# EasyEDA Pro project alarm.eprj

# Schematic 简易闹钟
Board Name: Board1; Create Date: 2024-09-03; Drawed: 陈家耀; Page Size: A3
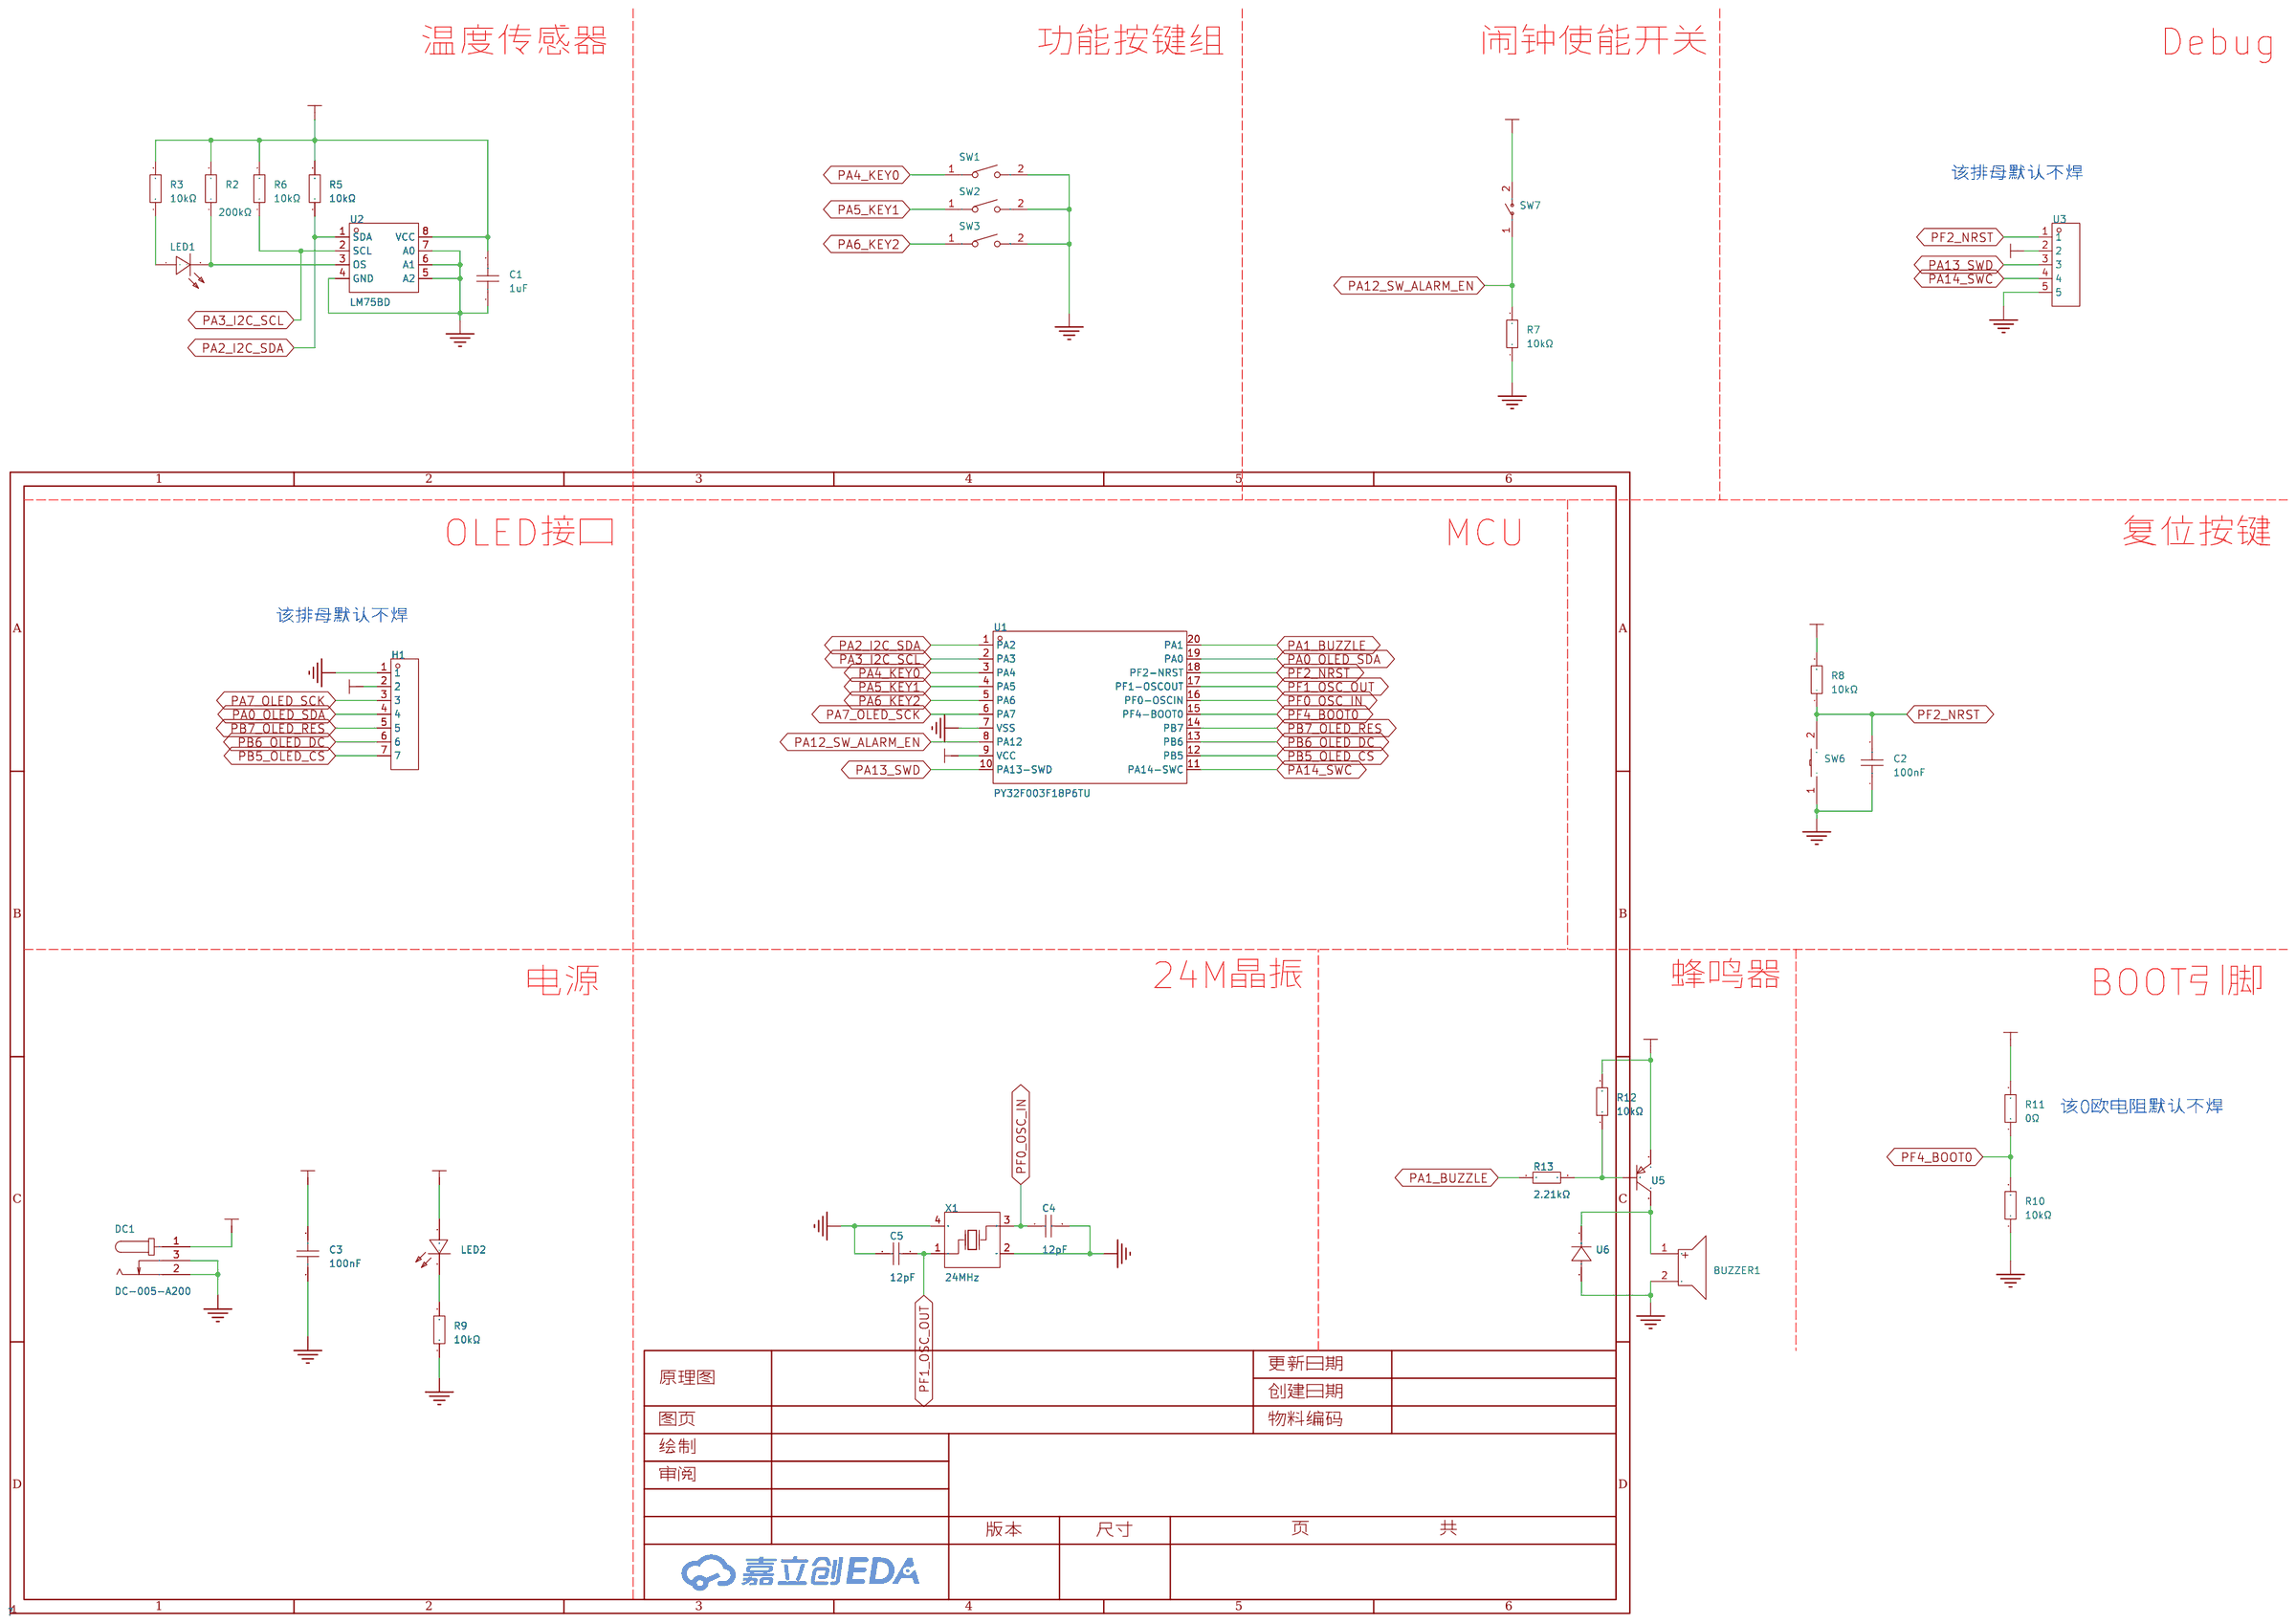
[diagram p0: schematic sheet]

## Parts
BUZZER1  2.7kHz  [BUZ-TH_BD9.0-P4.00-D0.6-FD]
C1  1uF  [C0603]
C2  100nF  [C0603]
C3  100nF  [C0603]
C4  12pF  [C0603]
C5  12pF  [C0603]
DC1  DC-005-A200  [DC-IN-TH_DC-005-A200]
H1  BX-PM2.54-1-7PY  [HDR-TH_7P-P2.54-V-F]
LED1  NCD0805R1  [LED0805-R-RD]
LED2  NCD0805R1  [LED0805-R-RD]
R2  200kΩ  [R0603]
R3  10kΩ  [R0603]
R5  10kΩ  [R0603]
R6  10kΩ  [R0603]
R7  10kΩ  [R0603]
R8  10kΩ  [R0603]
R9  10kΩ  [R0603]
R10  10kΩ  [R0603]
R11  0Ω  [R0805]
R12  10kΩ  [R0603]
R13  2.21kΩ  [R0603]
SW1  TS-1088-AR02016  [SW-SMD_L3.9-W3.0-P4.45]
SW2  TS-1088-AR02016  [SW-SMD_L3.9-W3.0-P4.45]
SW3  TS-1088-AR02016  [SW-SMD_L3.9-W3.0-P4.45]
SW6  TS-1101-C-W  [SW-SMD_L6.0-W3.3-LS8.0]
SW7  KCD11-2P-R  [SW-TH_2P-L15.0-W10.5-P5.00_KCD11-2P-R]
U1  PY32F003F18P6TU  [TSSOP-20_L6.5-W4.4-P0.65-LS6.4-BL]
U2  LM75BD  [SOIC-8_L4.9-W3.9-P1.27-LS6.0-BL]
U3  BX-PM2.54-1-5PY  [HDR-TH_5P-P2.54-V-F-B]
U5  MMBT3906  [SOT-23-3_L2.9-W1.3-P1.90-LS2.4-BR]
U6  1N4007W  [SOD-123FL_L2.7-W1.8-LS3.7-RD]
X1  24MHz  [CRYSTAL-SMD_4P-L3.2-W2.5-BL]

## Library data of the parts
BUZZER1 = QMB-09B-03: LCSC Part Name: 无源蜂鸣器QMB-09B-03; Supplier Part: C96256; Manufacturer: 华能; Supplier Footprint: 插件,D=9mm; Datasheet: https://atta.szlcsc.com/upload/public/pdf/source/20210401/C96256_958B17753B5AD7CBFBCFFC7C095B4484.pdf; Supplier: LCSC; Oscillator Circuit: 无源(外部驱动); Technology Type: 电磁式; Operating Voltage: 2V~5V; Sound Pressure Level (SPL): 85dB@3V,10cm; Diameter (φD): 9mm; Height: 5.7mm
C1 = CL10A105KB8NNNC: LCSC Part Name: 1uF ±10% 50V; Supplier Part: C15849; Manufacturer: SAMSUNG(三星); Supplier Footprint: 0603; Datasheet: https://atta.szlcsc.com/upload/public/pdf/source/20160218/1457707763339.pdf; Supplier: LCSC; Tolerance: ±10%; Voltage Rated: 50V; Temperature Coefficient: X5R
C2 C3 = CL10B104KB8NNNC: LCSC Part Name: 100nF ±10% 50V; Supplier Part: C1591; Manufacturer: SAMSUNG(三星); Supplier Footprint: 0603; Datasheet: https://atta.szlcsc.com/upload/public/pdf/source/20160218/1457707763339.pdf; Supplier: LCSC; Tolerance: ±10%; Voltage Rated: 50V; Temperature Coefficient: X7R
C4 C5 = CL10C120JB8NNNC: LCSC Part Name: 12pF ±5% 50V; Supplier Part: C38523; Manufacturer: SAMSUNG(三星); Supplier Footprint: 0603; Datasheet: https://atta.szlcsc.com/upload/public/pdf/source/20160218/1457707763339.pdf; Supplier: LCSC; Tolerance: ±5%; Voltage Rated: 50V; Temperature Coefficient: C0G
DC1 = DC-005-A200: LCSC Part Name: DC电源插座 内径:2mm 外径:6.4mm; Supplier Part: C720557; Manufacturer: XUNPU(讯普); Supplier Footprint: 插件; Datasheet: https://atta.szlcsc.com/upload/public/pdf/source/20200812/C720557_2286DFCD6C75B71AF905731F627ABF3A.pdf; Supplier: LCSC; Connector Type: DC电源插座; Mounting Style: 弯插; Inside Contact Diameter: 2mm; Outside Contact Diameter: 6.4mm; Current Rating (Max): 3A; Voltage Rating (Max): 30V; Operating Temperature Range: -20℃~+70℃
H1 = BX-PM2.54-1-7PY: LCSC Part Name: 1x7P 间距:2.54mm 直插; Supplier Part: C18078130; Manufacturer: Bossie(博锡); Supplier Footprint: 插件,P=2.54mm; Datasheet: https://atta.szlcsc.com/upload/public/pdf/source/20231017/5D8BA458A6A85FFD30CE44A2A3748583.pdf; Supplier: LCSC; Holes Structure: 1x7P; Pitch: 2.54mm; Circular Hole / Square Hole: 方孔; Mounting Type: 直插; Number of Rows: 单排; Number of Holes: 7P; Voltage Rating (Max): 1kV; Holes Direction: 顶部; Insulation Height: 8.5mm; Contact Plating: 金; Operating Temperature Range: -40℃~+105℃; Soldering Temperature(Max): 260℃@5S
LED1 LED2 = NCD0805R1: Supplier Part: C84256; Manufacturer: 国星光电; Supplier Footprint: 0805; Datasheet: https://atta.szlcsc.com/upload/public/pdf/source/20200820/C84256_F0A75A43B3EAD75808600A0514C76B99.pdf; Supplier: LCSC; Emitted Color: 红色; Forward Voltage (VF): 1.6V~2.6V; Power Dissipation: 65mW; Forward Current: 20mA; Dominant Wavelength: 615nm~630nm; Diode Configuration: 独立二极管; Lens Color: 无色透明透镜; Luminous Intensity: 67mcd~195mcd; Viewing Angle: 130°; Operating Temperature: -30℃~+85℃
R2 = 0603WAF2003T5E: LCSC Part Name: 200kΩ ±1% 100mW 厚膜电阻; Supplier Part: C25811; Manufacturer: UNI-ROYAL(厚声); Supplier Footprint: 0603; Datasheet: https://atta.szlcsc.com/upload/public/pdf/source/20200306/C422600_1E6D84923E4A46A82E41ADD87F860B5C.pdf; Supplier: LCSC; Type: 厚膜电阻; Tolerance: ±1%; Power(Watts): 100mW; Overload Voltage (Max): 75V; Temperature Coefficient: ±100ppm/℃; Operating Temperature Range: -55℃~+155℃
R3 R5-R10 R12 = 0603WAF1002T5E: LCSC Part Name: 厚膜电阻 10kΩ ±1% 100mW; Supplier Part: C25804; Manufacturer: UNI-ROYAL(厚声); Supplier Footprint: 0603; Datasheet: https://atta.szlcsc.com/upload/public/pdf/source/20200306/C422600_1E6D84923E4A46A82E41ADD87F860B5C.pdf; Supplier: LCSC; Type: 厚膜电阻; Tolerance: ±1%; Power(Watts): 100mW; Overload Voltage (Max): 75V; Temperature Coefficient: ±100ppm/℃; Operating Temperature Range: -55℃~+155℃
R11 = 0805W8F0000T5E: LCSC Part Name: 0Ω ±1% 125mW 厚膜电阻; Supplier Part: C17477; Manufacturer: UNI-ROYAL(厚声); Supplier Footprint: 0805; Datasheet: https://atta.szlcsc.com/upload/public/pdf/source/20200306/C422600_1E6D84923E4A46A82E41ADD87F860B5C.pdf; Supplier: LCSC; Type: 厚膜电阻; Tolerance: ±1%; Power(Watts): 125mW; Overload Voltage (Max): 150V; Temperature Coefficient: ±800ppm/℃; Operating Temperature Range: -55℃~+155℃
R13 = 0603WAF2211T5E: LCSC Part Name: 2.21kΩ ±1% 100mW 厚膜电阻; Supplier Part: C22903; Manufacturer: UNI-ROYAL(厚声); Supplier Footprint: 0603; Datasheet: https://atta.szlcsc.com/upload/public/pdf/source/20200306/C422600_1E6D84923E4A46A82E41ADD87F860B5C.pdf; Supplier: LCSC; Type: 厚膜电阻; Tolerance: ±1%; Power(Watts): 100mW; Overload Voltage (Max): 75V; Temperature Coefficient: ±100ppm/℃; Operating Temperature Range: -55℃~+155℃
SW1-SW3 = TS-1088-AR02016: LCSC Part Name: 4*3*2mm 立贴 轻触开关; Supplier Part: C720477; Manufacturer: XUNPU(讯普); Supplier Footprint: SMD; Datasheet: https://atta.szlcsc.com/upload/public/pdf/source/20200810/C720475_60D09DD6C54279ADDB2DC25100F1CC11.pdf; Supplier: LCSC; Circuit: 单刀单掷; Actuator Style: 圆形按钮; Operating Force: 160gf; Mounting Style: 立贴; Switch Length: 4mm; Switch Width: 3mm; Switch Height: 2mm; Strike Gundam: 不带; Contact Current: 50mA; Voltage Rating (DC): 12V; Insulation Resistance: 100MΩ; Actuator/Cap Color: 黑色; Pin Style: SMD接片; Mechanical Life: 10万次; Operating Temperature: -30℃~+80℃
SW6 = TS-1101-C-W: LCSC Part Name: 6*3.6*2.5mm 立贴 轻触开关; Supplier Part: C318938; Manufacturer: XKB Connectivity(中国星坤); Supplier Footprint: SMD; Datasheet: https://atta.szlcsc.com/upload/public/pdf/source/20200227/C318938_C2E53B1EEDE37D980A33616AC086DE53.pdf; Supplier: LCSC; Circuit: 单刀单掷; Actuator Style: 矩形按钮; Operating Force: 260gf; Mounting Style: 立贴; Switch Length: 6mm; Switch Width: 3.6mm; Switch Height: 2.5mm; Strike Gundam: 不带; Contact Current: 50mA; Voltage Rating (DC): 12V; Actuator/Cap Color: 白色带淡绿; With Lamp: 无; Mechanical Life: 5万次; Operating Temperature: -30℃~+85℃
SW7 = KCD11-2P-R: LCSC Part Name: 10.5*15mm 两脚两档跷板开关 红钮; Supplier Part: C5884414; Manufacturer: SHOU HAN(首韩); Supplier Footprint: 插件; Datasheet: https://atta.szlcsc.com/upload/public/pdf/source/20230506/CD06DFDE35C8048D34175BFF4AF6A2C2.pdf; Supplier: LCSC; Switch Length: 15mm; Switch Width: 10.5mm; Switch Height: 17.2mm; Actuator Type: 凹面弯曲; With Lamp: 无; Pin Style: 焊片; Actuator Color: 红色; Contact Current: 3A; Voltage Rating (AC): 250V; Circuit: 单刀单掷; Mechanical Life: 1万次; Operating Temperature: 0℃~+125℃; Actuator Identifier: - O
U1 = PY32F003F18P6TU: Supplier Part: C5379864; Manufacturer: PUYA(普冉); Supplier Footprint: TSSOP-20; Datasheet: https://atta.szlcsc.com/upload/public/pdf/source/20230614/9147D3030DCA6028D4889DF7CC1D56F6.pdf; Supplier: LCSC
U2 = LM75BD: Supplier Part: C725792; Manufacturer: UMW(友台半导体); Supplier Footprint: SOIC-8; Datasheet: https://atta.szlcsc.com/upload/public/pdf/source/20231109/1C60228B21A525FC8BE076B0D6A6FC17.pdf; Supplier: LCSC; Temperature range: -55℃~+125℃; Resolution: ±3℃; Supply Voltage: 2.8V~5.5V; Interface Type: I2C
U3 = BX-PM2.54-1-5PY: LCSC Part Name: 1x5P 间距:2.54mm 直插; Supplier Part: C18078128; Manufacturer: Bossie(博锡); Supplier Footprint: 插件,P=2.54mm; Datasheet: https://atta.szlcsc.com/upload/public/pdf/source/20231017/37C8F5FAB43404E6812AB2AE4BBAB039.pdf; Supplier: LCSC; Holes Structure: 1x5P; Pitch: 2.54mm; Circular Hole / Square Hole: 方孔; Mounting Type: 直插; Number of Rows: 单排; Number of Holes: 5P; Voltage Rating (Max): 1kV; Holes Direction: 顶部; Insulation Height: 8.5mm; Contact Plating: 金; Operating Temperature Range: -40℃~+105℃; Soldering Temperature(Max): 260℃@5S
U5 = MMBT3906_C7420354: LCSC Part Name: 耐压:40V 电流:200mA PNP; Supplier Part: C7420354; Manufacturer: 宏迦橙; Supplier Footprint: SOT-23; Datasheet: https://atta.szlcsc.com/upload/public/pdf/source/20231222/C57AF7F09D8B4437DE7730975D81C46C.pdf; Supplier: LCSC; Transistor Type: PNP; Collector Current (Ic): 200mA; Collector-Emitter Breakdown Voltage (Vceo): 40V; Power Dissipation (Pd): 300mW; DC Current Gain (hFE@Ic,Vce): 100@10mA,1.0V; Transition Frequency (fT): 300MHz; Collector Cut-Off Current (Icbo): 100nA; Collector-Emitter Saturation Voltage (VCE(sat)@Ic,Ib): 300mV@50mA,5.0mA; Operating Temperature: -55℃~+150℃
U6 = 1N4007W_C7528871: LCSC Part Name: 电压:1kV 电流:1A; Supplier Part: C7528871; Manufacturer: MSKSEMI(美森科); Supplier Footprint: SOD-123FL; Datasheet: https://atta.szlcsc.com/upload/public/pdf/source/20230821/E9E7B8A13216AEAB33D679873610DFE6.pdf; Supplier: LCSC; Diode Configuration: 独立式; Forward Voltage (Vf@If): 1.1V@1A; Reverse Voltage (Vr): 1kV; Rectified Current: 1A
X1 = X322524MOB4SI: LCSC Part Name: 24MHz ±10ppm 12pF; Supplier Part: C70590; Manufacturer: YXC(扬兴晶振); Supplier Footprint: SMD3225-4P; Datasheet: https://atta.szlcsc.com/upload/public/pdf/source/20240329/19D5F850207469550BEB00D7DFEDBC7A.pdf; Supplier: LCSC; Crystal Type: 贴片晶振; Normal temperature Frequency Tolerance: ±10ppm; External load capacitor: 12pF; Frequency Stability(Full temperature range): ±20ppm; Operating Temperature: -40℃~+85℃

## Nets
3V3: C1.2 C3.2 DC1.1 H1.2 LED2.1(+) R2.2 R3.2 R5.2 R6.2 R8.2 R11.2 R12.2 SW7.2 U1.9(VCC) U2.8(VCC) U3.2 U5.2(E)
GND: BUZZER1.2 C1.1 C2.1 C3.1 C4.2 C5.1 DC1.2 DC1.3 H1.1 R7.1 R9.1 R10.1 SW1.2 SW2.2 SW3.2 SW6.1 U1.7(VSS) U2.4(GND) U2.5(A2) U2.6(A1) U2.7(A0) U3.5 U6.2(A) X1.2(GND) X1.4(GND)
PA0_OLED_SDA: H1.4 U1.19(PA0)
PA1_BUZZLE: R13.1 U1.20(PA1)
PA2_I2C_SDA: R5.1 U1.1(PA2) U2.1(SDA)
PA3_I2C_SCL: R6.1 U1.2(PA3) U2.2(SCL)
PA4_KEY0: SW1.1 U1.3(PA4)
PA5_KEY1: SW2.1 U1.4(PA5)
PA6_KEY2: SW3.1 U1.5(PA6)
PA7_OLED_SCK: H1.3 U1.6(PA7)
PA12_SW_ALARM_EN: R7.2 SW7.1 U1.8(PA12)
PA13_SWD: U1.10(PA13-SWD) U3.3
PA14_SWC: U1.11(PA14-SWC) U3.4
PB5_OLED_CS: H1.7 U1.12(PB5)
PB6_OLED_DC: H1.6 U1.13(PB6)
PB7_OLED_RES: H1.5 U1.14(PB7)
PF0_OSC_IN: C4.1 U1.16(PF0-OSCIN) X1.3(OSC2)
PF1_OSC_OUT: C5.2 U1.17(PF1-OSCOUT) X1.1(OSC1)
PF2_NRST: C2.2 R8.1 SW6.2 U1.18(PF2-NRST) U3.1
PF4_BOOT0: R10.2 R11.1 U1.15(PF4-BOOT0)
$1N1333: LED1.2(-) R2.1 U2.3(OS)
$1N1526: LED1.1(+) R3.1
$1N4383: LED2.2(-) R9.2
$1N7361: R12.1 R13.2 U5.1(B)
$1N7544: BUZZER1.1 U5.3(C) U6.1(K)

## Notes on the sheet
- 温度传感器
- 功能按键组
- 闹钟使能开关
- Debug
- 该排母默认不焊
- OLED接口
- MCU
- 复位按键
- 该排母默认不焊
- 24M晶振
- 蜂鸣器
- 电源
- BOOT引脚
- 该0欧电阻默认不焊

# Board PCB1
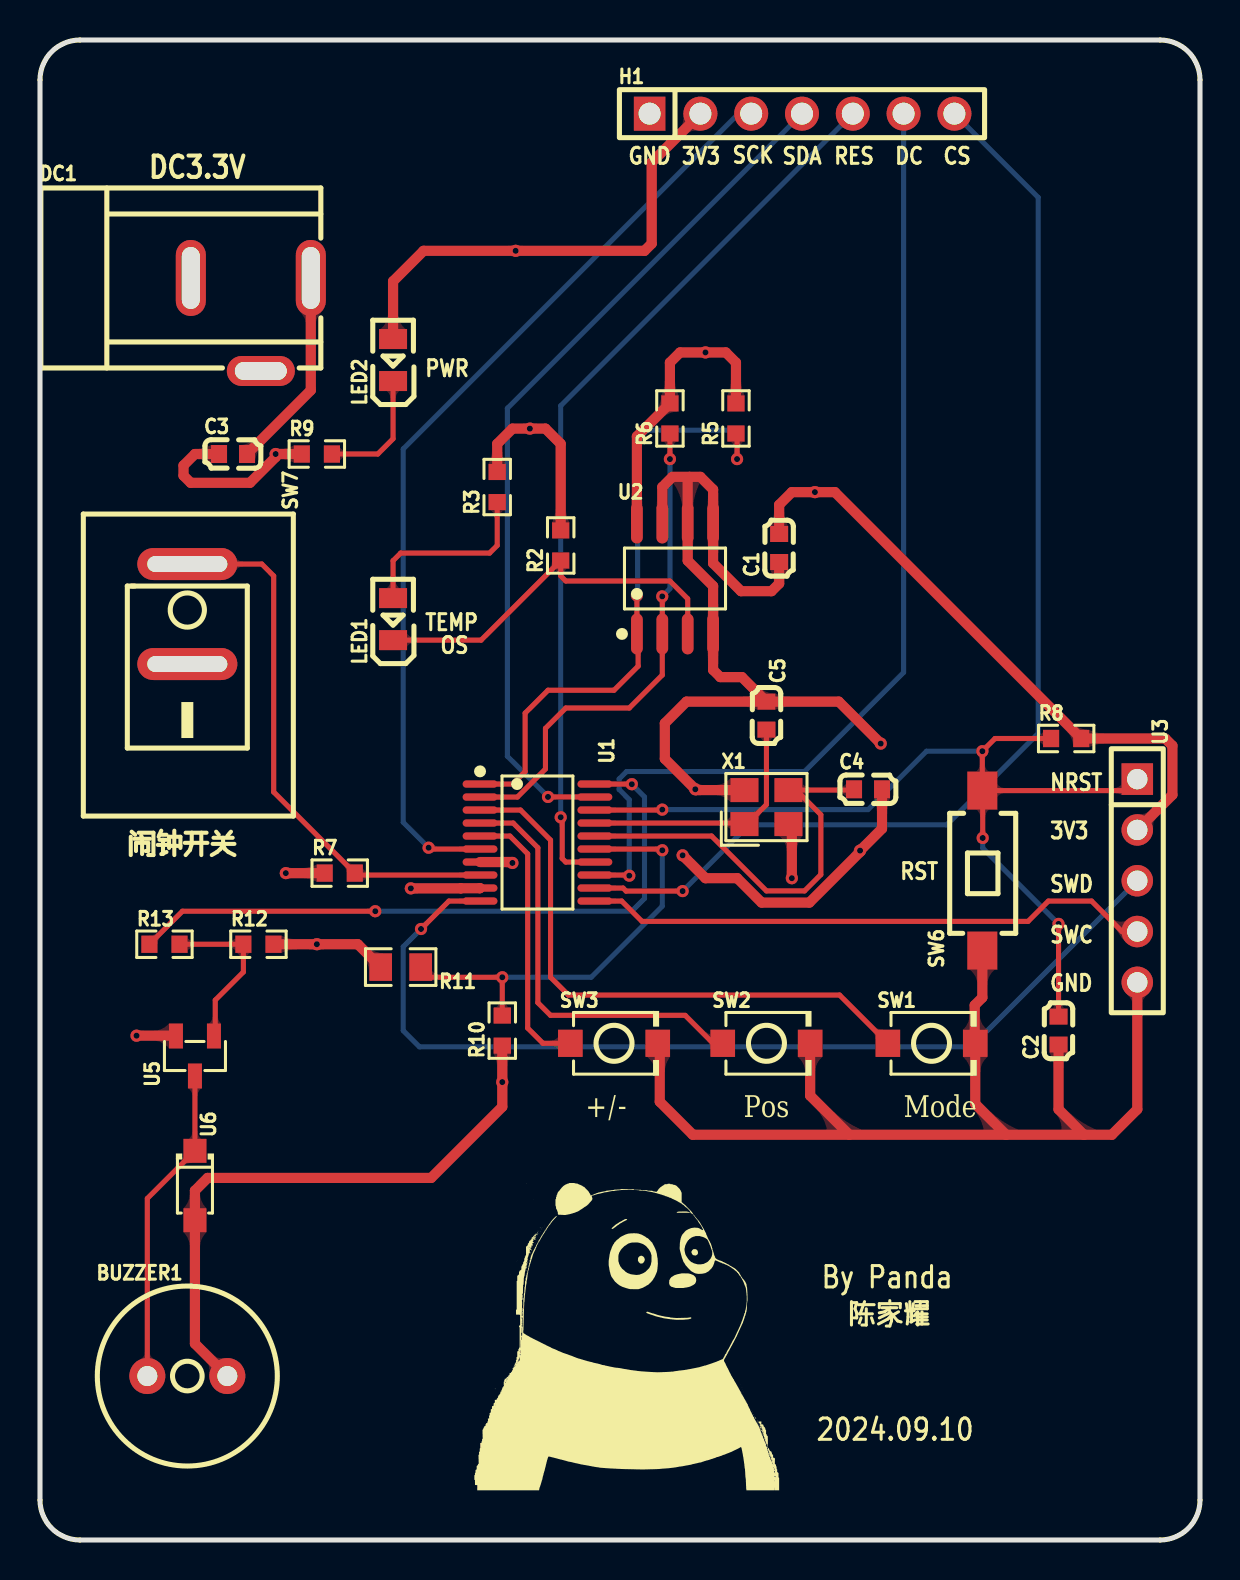
[diagram p1: board, top side]
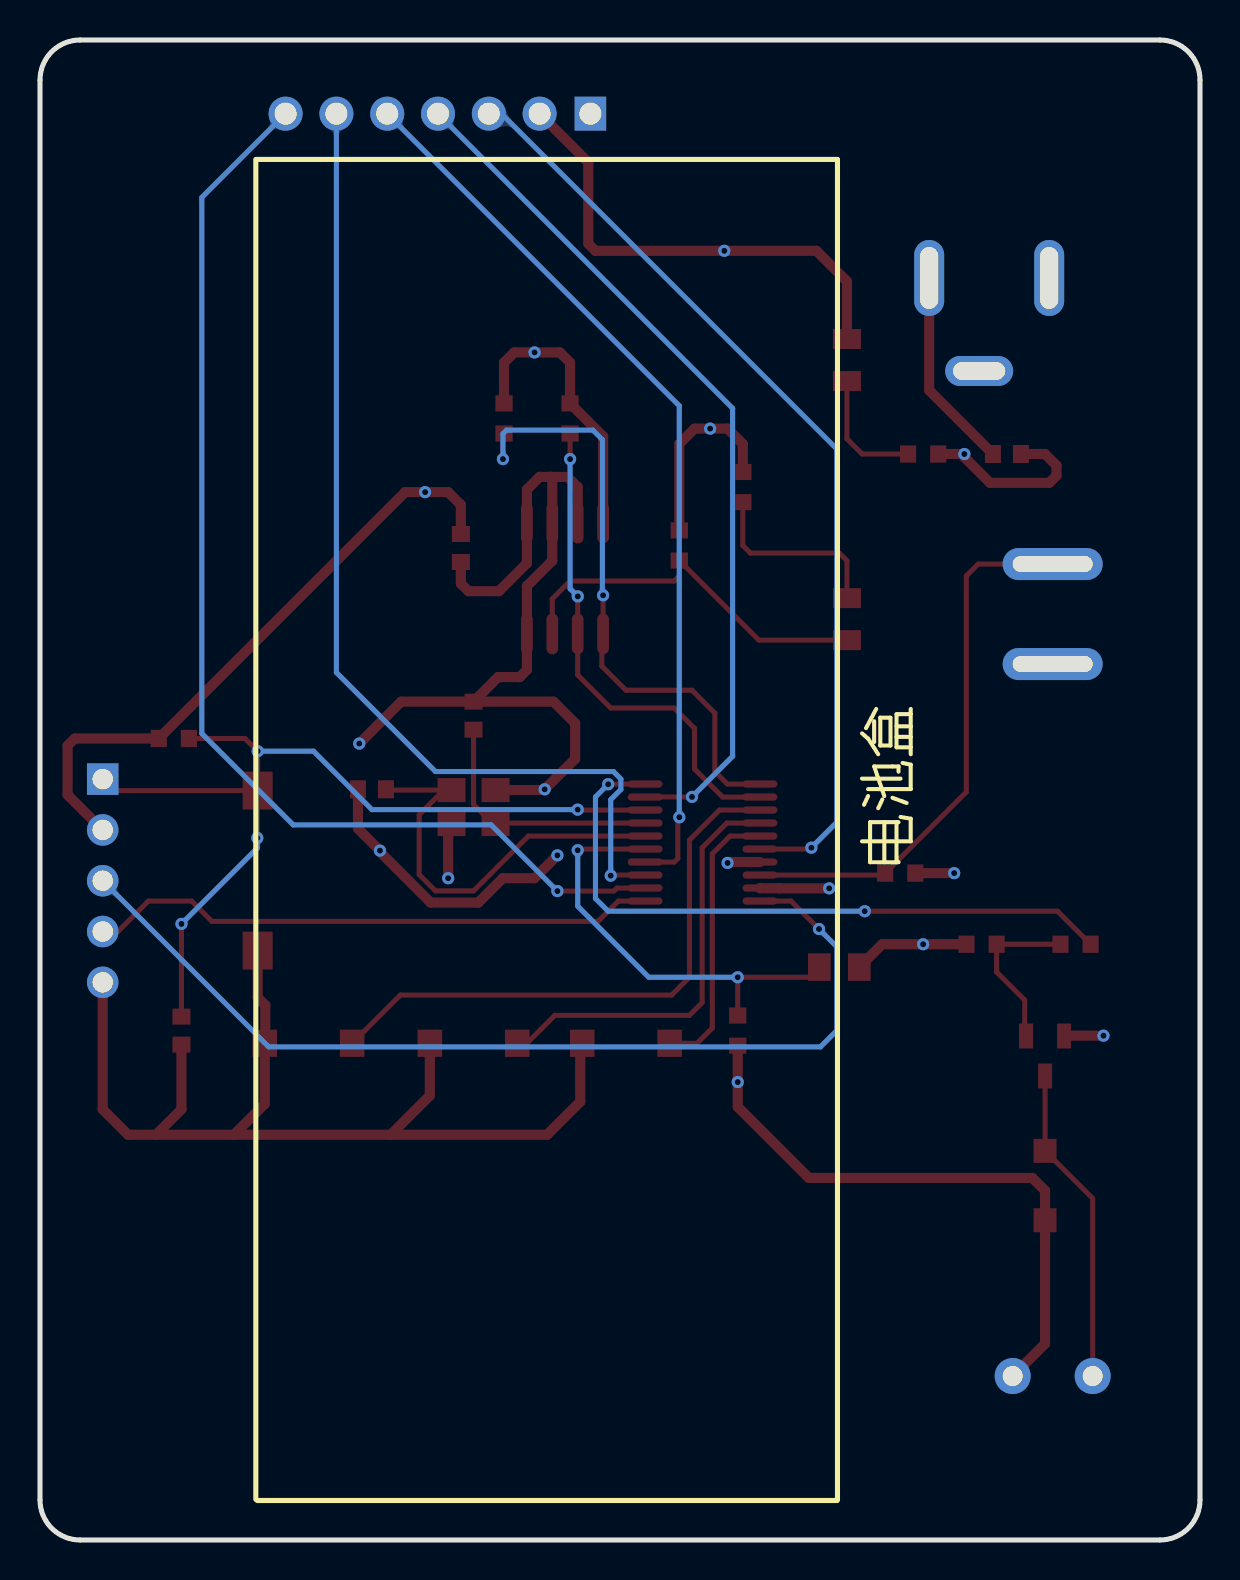
[diagram p2: board, bottom side, seen from below]

Outline 58 x 75 mm; copper layers: Top Layer, Inner1, Inner2, Bottom Layer. Coordinates in mm from the lower left corner of the outline.
Outline path: 0,73 0,2 arc(0.59,0.59) 2,0 56,0 arc(57.41,0.59) 58,2 58,73 arc(57.41,74.41) 56,75 2,75 arc(0.59,74.41) 0,73
Stack: Top Layer 0.035mm 外层铜厚1oz / Dielectric1 0.2104mm 7628 RC49% 8.6mil / Inner1 0.0152mm 内层铜厚 / Dielectric2 1.065mm 1.1mm H/HOZ Copper / Inner2 0.0152mm 内层铜厚 / Dielectric3 0.2104mm 7628 RC49% 8.6mil / Bottom Layer 0.035mm 外层铜厚1oz

## Design rules (mm)
net GND: pwr
net 3V3: pwr
template: 自定义配置
spacing copperThickness1oz (default): track to track 0.203, other pairs 0.203 to 0.203
spacing copperThickness2oz: track to track 0.203, other pairs 0.152 to 0.3
track width copperThickness1oz (default): min 0.152, default 0.254, max 2.54
track width copperThickness2oz: min 0.203, default 0.254, max 2.54
track width pwr: min 0.508, default 0.508, max 2.54
differential pair differentialPair (default): width min 0.152, default 0.254, max 2.54; gap min 0.152, default 0.152
via viaSize (default): diameter min 0.61, default 0.61, max 10; hole min 0.305, default 0.305, max 6.299
net class pwr uses pwr
net GND uses pwr
net 3V3 uses pwr

## Placement (name value [footprint] x y rotation side)
BUZZER1  2.7kHz  [BUZ-TH_BD9.0-P4.00-D0.6-FD]  7.37 8.2 0 top
C1  1uF  [C0603]  36.96 49.6 90 top
C2  100nF  [C0603]  50.93 25.47 90 top
C3  100nF  [C0603]  9.65 54.3 0 top
C4  12pF  [C0603]  41.4 37.53 0 top
C5  12pF  [C0603]  36.32 41.22 270 top
DC1  DC-005-A200  [DC-IN-TH_DC-005-A200]  10.54 60.78 0 top
H1  BX-PM2.54-1-7PY  [HDR-TH_7P-P2.54-V-F]  38.1 71.32 0 top
LED1  NCD0805R1  [LED0805-R-RD]  17.65 46.04 90 top
LED2  NCD0805R1  [LED0805-R-RD]  17.65 59 90 top
R2  200kΩ  [R0603]  26.03 49.73 90 top
R3  10kΩ  [R0603]  22.86 52.65 90 top
R5  10kΩ  [R0603]  34.8 56.08 90 top
R6  10kΩ  [R0603]  31.5 56.08 90 top
R7  10kΩ  [R0603]  14.99 33.34 0 top
R8  10kΩ  [R0603]  51.31 40.08 0 top
R9  10kΩ  [R0603]  13.84 54.3 0 top
R10  10kΩ  [R0603]  23.11 25.47 90 top
R11  0Ω  [R0805]  18.03 28.64 180 top
R12  10kΩ  [R0603]  10.92 29.79 0 top
R13  2.21kΩ  [R0603]  6.22 29.79 0 top
SW1  TS-1088-AR02016  [SW-SMD_L3.9-W3.0-P4.45]  44.58 24.83 0 top
SW2  TS-1088-AR02016  [SW-SMD_L3.9-W3.0-P4.45]  36.32 24.83 0 top
SW3  TS-1088-AR02016  [SW-SMD_L3.9-W3.0-P4.45]  28.7 24.83 0 top
SW6  TS-1101-C-W  [SW-SMD_L6.0-W3.3-LS8.0]  47.12 33.47 90 top
SW7  KCD11-2P-R  [SW-TH_2P-L15.0-W10.5-P5.00_KCD11-2P-R]  7.37 46.3 270 top
U1  PY32F003F18P6TU  [TSSOP-20_L6.5-W4.4-P0.65-LS6.4-BL]  24.87 34.87 270 top
U2  LM75BD  [SOIC-8_L4.9-W3.9-P1.27-LS6.0-BL]  31.75 48.08 0 top
U3  BX-PM2.54-1-5PY  [HDR-TH_5P-P2.54-V-F-B]  54.86 32.96 270 top
U5  MMBT3906  [SOT-23-3_L2.9-W1.3-P1.90-LS2.4-BR]  7.75 24.2 90 top
U6  1N4007W  [SOD-123FL_L2.7-W1.8-LS3.7-RD]  7.75 17.72 270 top
X1  24MHz  [CRYSTAL-SMD_4P-L3.2-W2.5-BL]  36.32 36.65 0 top

## Footprints (pads in the part's own frame, mm; a bottom-side part is the same pattern mirrored in y, then rotated)
BUZ-TH_BD9.0-P4.00-D0.6-FD
  round 1.8 hole 1: 1(-2,0) 2(2,0)
C0603
  rect 0.8x0.9 smd: 1(-0.7,0) 2(0.7,0)
CRYSTAL-SMD_4P-L3.2-W2.5-BL
  rect 1.4x1.2 smd: 1(-1.1,-0.85) 2(1.1,-0.85) 3(1.1,0.85) 4(-1.1,0.85)
DC-IN-TH_DC-005-A200
  oval 1.5x3.8 hole 0.9x3.1: 1(2.999,2.325) 2(-3,2.325)
  oval 3.4x1.5 hole 2.6x0.9: 3(0.5,-2.325)
HDR-TH_5P-P2.54-V-F-B
  rect 1.575x1.575 hole 1.02: 1(-5.08,0)
  round 1.575 hole 1.02: 2(-2.54,0) 3(0,0) 4(2.54,0) 5(5.08,0)
HDR-TH_7P-P2.54-V-F
  rect 1.575x1.7 hole 1.1: 1(-7.62,0)
  round 1.7 hole 1.1: 2(-5.08,0) 3(-2.54,0) 4(0,0) 5(2.54,0) 6(5.08,0) 7(7.62,0)
LED0805-R-RD
  rect 1x1.399 smd: 1(1.05,0) 2(-1.05,0)
R0603
  rect 0.806x0.864 smd: 1(-0.753,0) 2(0.753,0)
R0805
  rect 1.133x1.377 smd: 1(-1,0) 2(1,0)
SOD-123FL_L2.7-W1.8-LS3.7-RD
  rect 1.2x1.15 smd: 1(-1.735,0) 2(1.735,0)
SOIC-8_L4.9-W3.9-P1.27-LS6.0-BL
  oval 0.588x2.045 smd: 1(-1.905,-2.772) 2(-0.635,-2.772) 3(0.635,-2.772) 4(1.905,-2.772) 5(1.905,2.772) 6(0.635,2.772) 7(-0.635,2.772) 8(-1.905,2.772)
SOT-23-3_L2.9-W1.3-P1.90-LS2.4-BR
  rect 1.25x0.7 smd: 1(1,-0.95) 2(1,0.95) 3(-1,0)
SW-SMD_L3.9-W3.0-P4.45
  rect 1.23x1.36 smd: 1(-2.185,0) 2(2.185,0)
SW-SMD_L6.0-W3.3-LS8.0
  rect 1.9x1.5 smd: 1(-4,0) 2(4,0)
SW-TH_2P-L15.0-W10.5-P5.00_KCD11-2P-R
  oval 1.6x5 hole 0.8x4: 1(-2.5,0) 2(2.5,0)
TSSOP-20_L6.5-W4.4-P0.65-LS6.4-BL
  oval 0.364x1.742 smd: 1(-2.925,-2.871) 2(-2.275,-2.871) 3(-1.625,-2.871) 4(-0.975,-2.871) 5(-0.325,-2.871) 6(0.325,-2.871) 7(0.975,-2.871) 8(1.625,-2.871) 9(2.275,-2.871) 10(2.925,-2.871) 11(2.925,2.871) 12(2.275,2.871) 13(1.625,2.871) 14(0.975,2.871) 15(0.325,2.871) 16(-0.325,2.871) 17(-0.975,2.871) 18(-1.625,2.871) 19(-2.275,2.871) 20(-2.925,2.871)

## Nets
As in the schematic.

## Via types
v1: diameter 0.61, hole 0.305, Top Layer to Bottom Layer, 34 vias

## Routing (per net, layer and track width the routed paths; a pad name or vN(x,y) marks a point on that pad's centre or on a via; arc(x,y) is an arc through that point)
3V3: length 200.5
  Top Layer w0.508: LED2.1 17.65,62.94 19.18,64.46 v1(23.78,64.46) 30.23,64.46 30.59,64.82 30.59,68.88 H1.2 ; R11.2 15.89,29.79 v1(13.84,29.79) R12.2 ; U3.2 56.62,37.26 56.62,39.72 56.26,40.08 R8.2 39.74,52.39 v1(38.74,52.39) 37.59,52.39 36.96,51.76 C1.2 ; R5.2 34.8,58.87 34.29,59.38 v1(33.27,59.38) 32,59.38 31.5,58.87 R6.2 29.84,55.18 U2.8 ; DC1.1 13.54,57.49 C3.2 ; v1(18.54,32.58) 21.04,32.58 21.05,32.59 21.99,32.59 U1.9 ; v1(4.83,25.22) 6.78,25.22 U5.2 ; R2.2 26.03,54.81 25.27,55.57 v1(24.49,55.57) 23.62,55.57 22.86,54.81 R3.2
  Inner2 w0.508: v1(24.49,55.57) 24.49,63.75 v1(23.78,64.46) ; v1(13.84,29.79) 16.89,29.79 17.53,30.42 17.53,31.57 v1(18.54,32.58) ; v1(13.84,29.79) 9.27,25.22 v1(4.83,25.22) ; v1(13.84,29.79) 13.84,37.32 SW7.2 7.45,43.89 11.81,43.89 13.54,45.61 DC1.1 14.9,64.46 v1(23.78,64.46) ; v1(23.78,64.46) 28.19,64.46 v1(33.27,59.38) 38.74,53.91 v1(38.74,52.39)
GND: length 364.1
  Top Layer w0.508: R7.1 v1(12.29,33.34) ; SW6.1 47.12,27.12 46.74,26.74 46.74,24.86 SW1.2 46.76,21.8 48.3,20.26 ; SW2.2 38.51,22.22 40.46,20.26 ; C5.1 32.32,41.92 31.24,40.84 31.24,39.06 v1(32.77,37.53) 32.81,37.5 X1.4 ; C5.1 35.09,43.14 34.01,43.14 33.66,43.5 U2.4 33.66,47.69 32.38,48.97 U2.6 32.38,53.06 32.48,53.16 ; C5.1 39.94,41.92 v1(42.04,39.82) ; 40.46,20.26 48.3,20.26 ; 40.46,20.26 32.64,20.26 30.99,21.91 30.99,24.73 SW3.2 ; 48.3,20.26 52.2,20.26 ; 32.48,53.16 31.62,53.16 31.12,52.65 U2.7 ; 32.48,53.16 33.02,53.16 33.66,52.52 U2.5 33.66,48.84 35.05,47.44 36.58,47.44 36.96,47.82 C1.1 ; U3.5 54.86,21.53 53.59,20.26 52.2,20.26 ; v1(37.59,33.09) 37.59,35.63 X1.2 ; U1.7 23.58,33.9 v1(23.62,33.85) ; 52.2,20.26 50.93,21.53 C2.1 ; C4.2 42.1,35.57 v1(41,34.47) 41,34.41 38.47,31.87 36.08,31.87 34.86,33.09 33.27,33.09 v1(32.13,34.23) ; C3.1 7.75,54.3 7.18,53.73 7.18,53.22 7.53,52.86 10.5,52.86 11.78,54.14 v1(11.78,54.3) R9.1 ; BUZZER1.2 7.75,9.82 U6.2 7.75,17.47 8.38,18.1 19.56,18.1 23.11,21.66 v1(23.11,22.9) R10.1
  Inner1 w0.508: H1.1 10.29,71.32 7.54,68.57 DC1.2 7.54,59.08 7.87,58.74 10.75,58.74 DC1.3 11.04,56.34 11.81,55.57 11.81,41.85 9.37,39.41 BUZZER1.2 9.49,8.07 46.74,8.07 54.86,16.2 U3.5 ; 54.61,27.88 42.8,27.88 v1(37.59,33.09) 33.27,33.09 v1(32.13,34.23) 32.13,36.9 v1(32.77,37.53) ; v1(12.29,33.34) 23.11,33.34 v1(23.62,33.85) 25.15,33.85 25.5,33.49 25.5,25.29 v1(23.11,22.9)
PA0_OLED_SDA: length 43.5
  Top Layer w0.254: U1.19 27.74,37.15 v1(25.4,37.15)
  Bottom Layer w0.254: v1(25.4,37.15) 23.37,39.19 23.37,56.58 H1.4
PA1_BUZZLE: length 33.5
  Top Layer w0.254: R13.1 7.12,31.44 v1(16.76,31.44) ; v1(29.59,37.79) 29.58,37.8 U1.20
  Bottom Layer w0.254: v1(16.76,31.44) 29.59,31.44 30.23,32.07 30.23,37.15 v1(29.59,37.79)
PA2_I2C_SDA: length 31.2
  Top Layer w0.254: R5.1 34.85,55.27 v1(34.85,54.05) ; U1.1 23.63,37.8 24.26,38.42 24.26,41.34 25.4,42.49 28.7,42.49 29.91,43.69 29.91,45.24 U2.1 v1(29.84,47.23)
  Bottom Layer w0.254: v1(34.85,54.05) 34.85,55.31 34.67,55.49 30.35,55.49 29.88,55.02 29.88,47.27 v1(29.84,47.23)
PA3_I2C_SCL: length 25.1
  Top Layer w0.254: R6.1 v1(31.5,54.05) ; U1.2 23.87,37.15 25.27,38.55 25.27,40.58 26.29,41.6 29.46,41.6 31.12,43.25 U2.2 31.12,47.18 v1(31.11,47.18)
  Bottom Layer w0.254: v1(31.11,47.18) 31.5,47.56 v1(31.5,54.05)
PA4_KEY0: length 29.2
  Top Layer w0.254: U1.3 24.02,36.5 25.53,35 25.53,28.14 26.42,27.25 39.98,27.25 SW1.1
PA5_KEY1: length 21.2
  Top Layer w0.254: SW2.1 33.66,24.83 32.26,26.23 25.53,26.23 24.89,26.87 24.89,34.61 23.66,35.85 U1.4
PA6_KEY2: length 13.9
  Top Layer w0.254: SW3.1 25.15,24.83 24.38,25.6 24.38,34.31 23.5,35.2 U1.5
PA7_OLED_SCK: length 47.4
  Top Layer w0.254: U1.6 19.5,34.55 v1(19.43,34.61)
  Bottom Layer w0.254: H1.3 34.93,71.32 18.16,54.55 18.16,35.88 v1(19.43,34.61)
PA12_SW_ALARM_EN: length 27.4
  Top Layer w0.254: SW7.1 11.09,48.8 11.68,48.2 11.68,37.4 R7.2 15.84,33.25 U1.8
PA13_SWD: length 49.5
  Top Layer w0.254: v1(19.05,30.55) 20.45,31.95 U1.10
  Bottom Layer w0.254: v1(19.05,30.55) 18.16,29.66 18.16,25.47 18.98,24.66 46.56,24.66 U3.3
PA14_SWC: length 28.6
  Top Layer w0.254: U1.11 29.08,31.95 30.1,30.93 49.4,30.93 50.42,31.95 52.58,31.95 54.1,30.42 54.86,30.42
PB5_OLED_CS: length 58.2
  Top Layer w0.254: v1(32.13,32.45) 29.31,32.45 29.15,32.6 U1.12
  Bottom Layer w0.254: v1(32.13,32.45) 35.44,35.76 45.34,35.76 49.91,40.33 49.91,67.13 H1.7
PB6_OLED_DC: length 51.1
  Top Layer w0.254: v1(29.46,33.22) 29.43,33.25 U1.13
  Bottom Layer w0.254: v1(29.46,33.22) 29.46,37.02 28.96,37.53 28.96,38.05 29.33,38.42 38.23,38.42 43.18,43.38 H1.6
PB7_OLED_RES: length 45
  Top Layer w0.254: v1(26.03,36.14) 26.11,36.06 26.11,34.08 26.29,33.9 U1.14
  Bottom Layer w0.254: v1(26.03,36.14) 26.03,56.71 H1.5
PF0_OSC_IN: length 20.8
  Top Layer w0.254: 37.81,37.5 X1.3 ; 37.81,37.5 40.66,37.5 C4.1 ; 37.81,37.5 39.04,36.27 39.04,33.27 38.23,32.45 36.32,32.45 33.58,35.2 U1.16
PF1_OSC_OUT: length 12.7
  Top Layer w0.254: C5.2 36.32,36.77 35.34,35.8 X1.1 35.17,35.85 U1.17
PF2_NRST: length 47.1
  Top Layer w0.254: SW6.2 v1(47.12,39.44) 47.75,40.08 R8.1 ; SW6.2 47.13,37.45 v1(47.13,35.1) ; SW6.2 54.29,37.47 54.86,38.04 ; v1(31.12,36.52) 31.09,36.5 U1.18 ; C2.2 v1(50.93,30.8)
  Bottom Layer w0.254: v1(50.93,30.8) 47.13,34.6 v1(47.13,35.1) ; v1(31.12,36.52) 41.4,36.52 44.32,39.44 v1(47.12,39.44)
PF4_BOOT0: length 21.9
  Top Layer w0.254: R11.1 19.54,28.14 v1(23.11,28.14) R10.2 ; v1(31.12,34.49) 31.05,34.55 U1.15
  Bottom Layer w0.254: v1(23.11,28.14) 27.56,28.14 31.12,31.69 v1(31.12,34.49)
$1N1333: length 19.4
  Top Layer w0.254: LED1.2 22.06,44.99 R2.1 26.03,48.2 26.29,47.95 31.5,47.95 32.38,47.06 U2.3
$1N1526: length 9.6
  Top Layer w0.254: LED1.1 17.65,48.97 18.03,49.35 22.48,49.35 22.86,49.73 R3.1
$1N4383: length 6.3
  Top Layer w0.254: LED2.2 17.65,55.06 16.89,54.3 R9.2
$1N7361: length 8.4
  Top Layer w0.254: R13.2 R12.1 10.17,28.4 8.76,26.99 8.76,25.27 U5.1
$1N7544: length 16
  Top Layer w0.254: U5.3 U6.1 5.37,17.08 BUZZER1.1

## Copper pours and planes (outline as drawn; the poured copper is in the pictures)
3V3 on Inner2: -7.37,81.1 64.01,81.1 64.01,-7.8 -7.37,-7.8
GND on Inner1: -7.11,81.48 63.12,81.48 63.12,-5.52 -7.11,-5.52

Small or netless copper shapes (teardrops, artwork), in the pictures only: 156 on Top Layer, 24 on Bottom Layer, 20 on Inner1, 16 on Inner2

## Text on the board
Bottom Silkscreen Layer: 电池盒
Top Silkscreen Layer: PWR | TEMP | OS | GND | 3V3 | SCK | SDA | RES | DC | RST | CS | NRST | SWD | SWC | 2024.09.10 | By Panda | DC3.3V | 陈家耀 | 闹钟开关 | +/- | Pos | Mode
